# EAGLE design powerblade_2v0 (EAGLE 6.5.0)

## Sheet 1 of 6: Current & Voltage Measurement
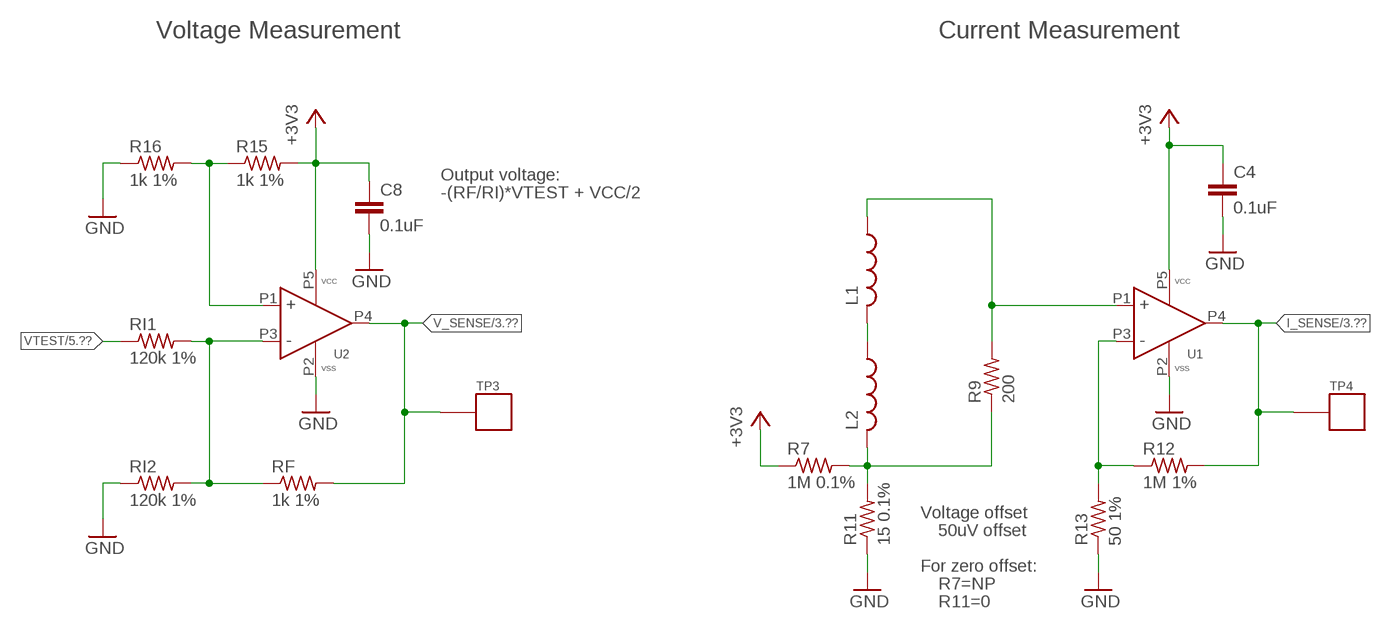
[diagram p0: schematic, sheet 1]

### Parts
C4  0.1uF  C-EUC0402  [C0402]
C8  0.1uF  C-EUC0402  [C0402]
L1  L-USL0805  [L0805]
L2  L-USL0805  [L0805]
R7  1M 0.1%  R-US_R0603  [R0603]
R9  200  R-US_R0603  [R0603]
R11  15 0.1%  R-US_R0603  [R0603]
R12  1M 1%  R-US_R0603  [R0603]
R13  50 1%  R-US_R0603  [R0603]
R15  1k 1%  R-US_R0603  [R0603]
R16  1k 1%  R-US_R0603  [R0603]
RF  1k 1%  R-US_R0603  [R0603]
RI1  120k 1%  R-US_R0603  [R0603]
RI2  120k 1%  R-US_R0603  [R0603]
TP3  TP_STD  [TP]
TP4  TP_STD  [TP]
U1  MAX9910  [SC70-5]
U2  MAX9910  [SC70-5]

### Nets
+3V3: C4.1 C8.1 R7.1 R15.2 U1.P5(VCC) U2.P5(VCC) ; also sheet 2,3,4,5,6
GND: C4.2 C8.2 R11.1 R13.1 R16.1 RI2.1 U1.P2(VSS) U2.P2(VSS) ; also sheet 2,3,4,5,6
I_SENSE: R12.2 TP4.P$1 U1.P4(OUT) ; also sheet 3,4
N$1: R15.1 R16.2 U2.P1(IN+)
N$9: R12.1 R13.2 U1.P3(IN-)
N$10: RF.1 RI1.2 RI2.2 U2.P3(IN-)
N$13: L2.2 R7.2 R9.1 R11.2
N$16: L1.1 R9.2 U1.P1(IN+)
N$25: L1.2 L2.1
V_SENSE: RF.2 TP3.P$1 U2.P4(OUT) ; also sheet 3,4
VTEST: RI1.1 ; also sheet 5

### Notes on the sheet
- Voltage Measurement | Current Measurement
- Output voltage:
- -(RF/RI)*VTEST + VCC/2
- Voltage offset
- 50uV offset
- For zero offset:
- R7=NP
- R11=0

## Sheet 2 of 6: WISP 5.0 Front End
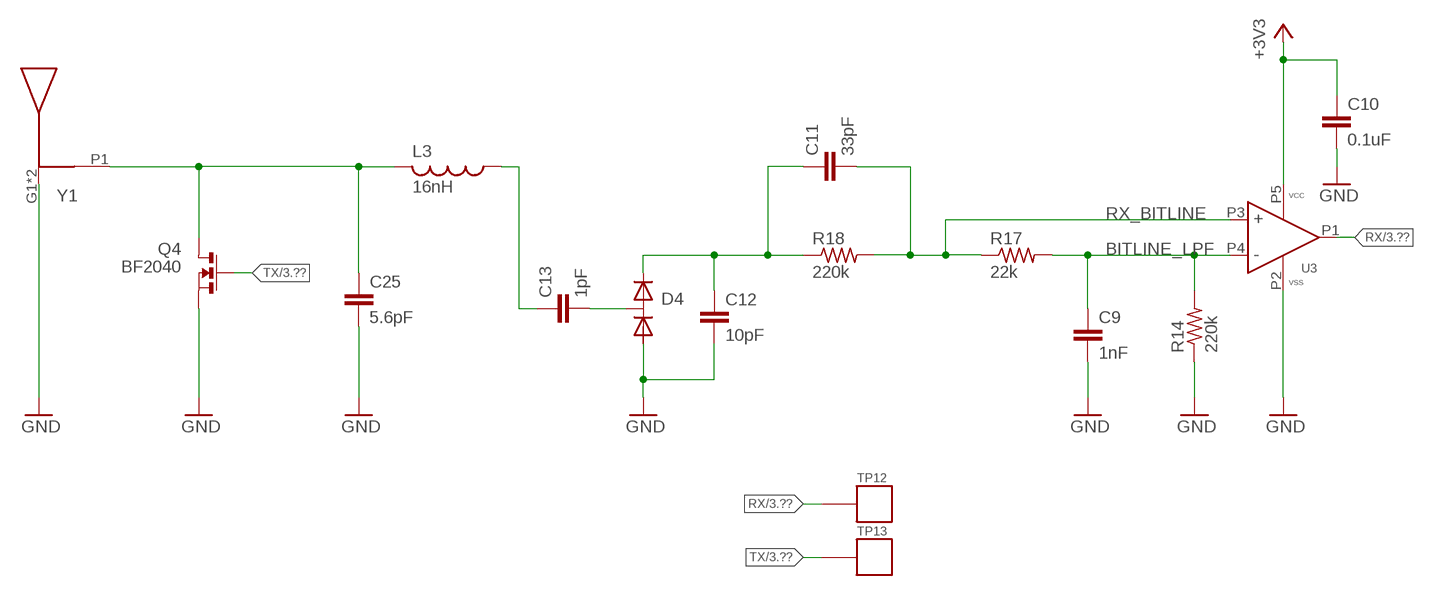
[diagram p1: schematic, sheet 2]

### Parts
C9  1nF  C-EUC0603  [C0603]
C10  0.1uF  C-EUC0603  [C0603]
C11  33pF  C-EUC0603  [C0603]
C12  10pF  C-EUC0603  [C0603]
C13  1pF  C-EUC0603  [C0603]
C25  5.6pF  C-EUC0603  [C0603]
D4  HSMS-285C  [SOT-323]
L3  16nH  L-USL0603  [L0603]
Q4  BF2040  [SOT-143]
R14  220k  R-US_R0603  [R0603]
R17  22k  R-US_R0603  [R0603]
R18  220k  R-US_R0603  [R0603]
TP12  TP_STD  [TP]
TP13  TP_STD  [TP]
U3  NCS2200S  [SC70-5]
Y1  ANT-USP  [ANT-USP]

### Nets
+3V3: C10.1 U3.P5(VCC) ; also sheet 1,3,4,5,6
ANT: C25.1 L3.2 Q4.P2(D) Y1.P1
BITLINE_LPF: C9.1 R14.2 R17.2 U3.P4(IN-)
GND: C9.2 C10.2 C12.2 C25.2 D4.P1 Q4.P1(S) R14.1 U3.P2(VSS) Y1.G1(G) Y1.G2(G) ; also sheet 1,3,4,5,6
N$4: C13.1 L3.1
N$21: C13.2 D4.P3
N$22: C11.1 C12.1 D4.P2 R18.1
RX: TP12.P$1 U3.P1(OUT) ; also sheet 3,4
RX_BITLINE: C11.2 R17.1 R18.2 U3.P3(IN+)
TX: Q4.P3(G) Q4.P4(G) TP13.P$1 ; also sheet 3,4

## Sheet 3 of 6: MSP430
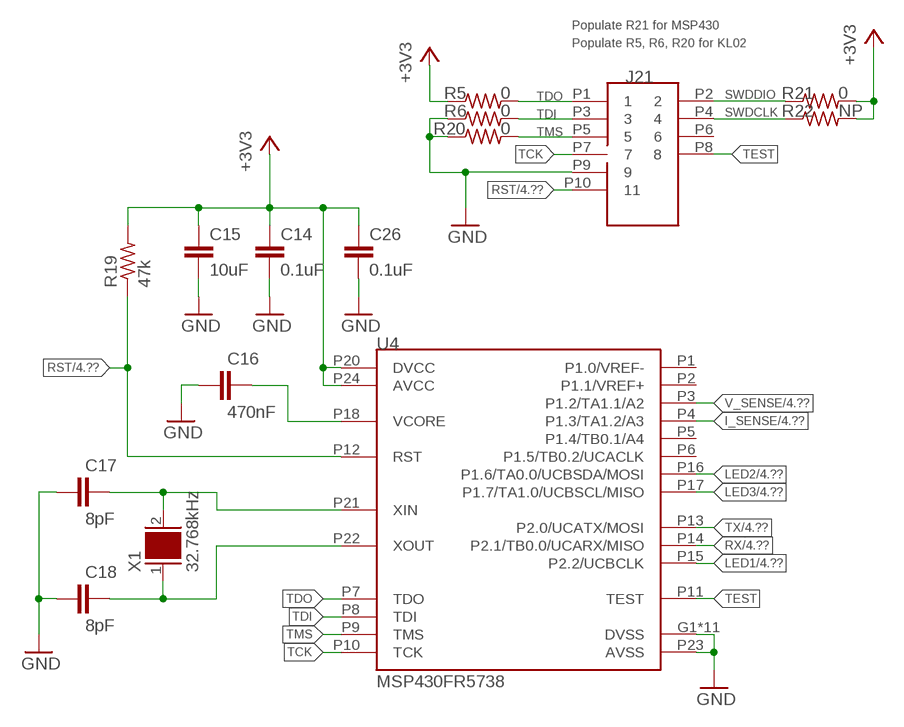
[diagram p2: schematic, sheet 3]

### Parts
C14  0.1uF  C-EUC0603  [C0603]
C15  10uF  C-EUC0603  [C0603]
C16  470nF  C-EUC0603  [C0603]
C17  8pF  C-EUC0603  [C0603]
C18  8pF  C-EUC0603  [C0603]
C26  0.1uF  C-EUC0603  [C0603]
J21  JTAG_14PIN_IDC-NL  [TC2050-IDC-NL-430]
R5  0  R-US_R0603  [R0603]
R6  0  R-US_R0603  [R0603]
R19  47k  R-US_R0603  [R0603]
R20  0  R-US_R0603  [R0603]
R21  0  R-US_R0603  [R0603]
R22  NP  R-US_R0603  [R0603]
U4  MSP430FR5738  [VQFN-24]
X1  32.768kHz  CRYSTAL_0805  [0805]

### Nets
+3V3: C14.1 C15.1 C26.1 R5.1 R19.2 R21.2 R22.2 U4.P20(DVCC) U4.P24(AVCC) ; also sheet 1,2,4,5,6
GND: C14.2 C15.2 C16.1 C17.1 C18.1 C26.2 J21.P9 R6.1 R20.1 U4.G1(DVSS) U4.G2(DVSS) U4.G3(DVSS) U4.G4(DVSS) U4.G5(DVSS) U4.G6(DVSS) U4.G7(DVSS) U4.G8(DVSS) U4.G9(DVSS) U4.P19(DVSS) U4.P23(AVSS) U4.PAD(DVSS) ; also sheet 1,2,4,5,6
I_SENSE: U4.P4(P1.3/TA1.2/A3) ; also sheet 1,4
LED1: U4.P15(P2.2/UCBCLK) ; also sheet 4,6
LED2: U4.P16(P1.6/TA0.0/UCBSDA/MOSI) ; also sheet 4,6
LED3: U4.P17(P1.7/TA1.0/UCBSCL/MISO) ; also sheet 4,6
N$19: C18.2 U4.P22(XOUT) X1.1
N$23: C16.2 U4.P18(VCORE)
N$24: C17.2 U4.P21(XIN) X1.2
RST: J21.P10 R19.1 U4.P12(RST) ; also sheet 4
RX: U4.P14(P2.1/TB0.0/UCARX/MISO) ; also sheet 2,4
SWDCLK: J21.P4 R22.1 ; also sheet 4
SWDDIO: J21.P2 R21.1 ; also sheet 4
TCK: J21.P7 U4.P10(TCK)
TDI: J21.P3 R6.2 U4.P8(TDI)
TDO: J21.P1 R5.2 U4.P7(TDO)
TEST: J21.P8 U4.P11(TEST)
TMS: J21.P5 R20.2 U4.P9(TMS)
TX: U4.P13(P2.0/UCATX/MOSI) ; also sheet 2,4
V_SENSE: U4.P3(P1.2/TA1.1/A2) ; also sheet 1,4
Unconnected: J21.P6 U4.P1(P1.0/VREF-) U4.P2(P1.1/VREF+) U4.P5(P1.4/TB0.1/A4) U4.P6(P1.5/TB0.2/UCACLK)

### Notes on the sheet
- Populate R21 for MSP430
- Populate R5, R6, R20 for KL02

## Sheet 4 of 6: KL02
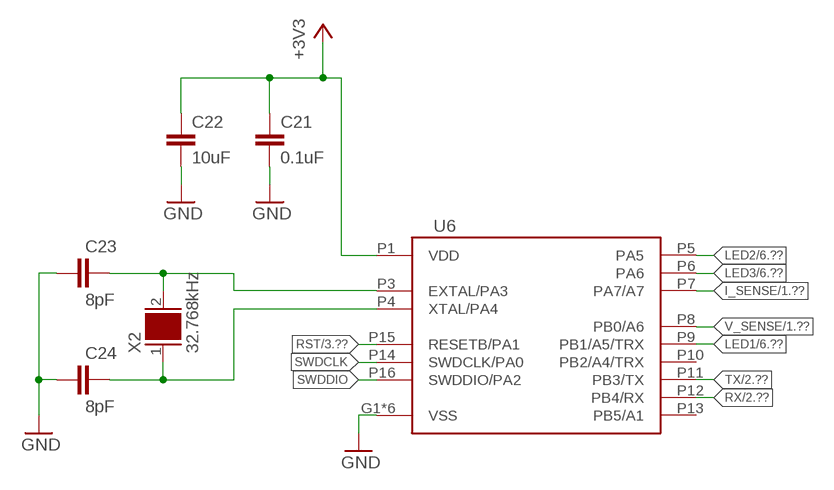
[diagram p3: schematic, sheet 4]

### Parts
C21  0.1uF  C-EUC0603  [C0603]
C22  10uF  C-EUC0603  [C0603]
C23  8pF  C-EUC0603  [C0603]
C24  8pF  C-EUC0603  [C0603]
U6  KL02  [WQFN-16]
X2  32.768kHz  CRYSTAL_0805  [0805]

### Nets
+3V3: C21.1 C22.1 U6.P1(VDD) ; also sheet 1,2,3,5,6
GND: C21.2 C22.2 C23.1 C24.1 U6.G1(VSS) U6.G3(VSS) U6.G7(VSS) U6.G9(VSS) U6.P2(VSS) U6.PAD(VSS) ; also sheet 1,2,3,5,6
I_SENSE: U6.P7(PA7/A7) ; also sheet 1,3
LED1: U6.P9(PB1/A5/TRX) ; also sheet 3,6
LED2: U6.P5(PA5) ; also sheet 3,6
LED3: U6.P6(PA6) ; also sheet 3,6
N$5: C24.2 U6.P4(XTAL/PA4) X2.1
N$6: C23.2 U6.P3(EXTAL/PA3) X2.2
RST: U6.P15(RESETB/PA1) ; also sheet 3
RX: U6.P12(PB4/RX) ; also sheet 2,3
SWDCLK: U6.P14(SWDCLK/PA0) ; also sheet 3
SWDDIO: U6.P16(SWDDIO/PA2) ; also sheet 3
TX: U6.P11(PB3/TX) ; also sheet 2,3
V_SENSE: U6.P8(PB0/A6) ; also sheet 1,3
Unconnected: U6.P10(PB2/A4/TRX) U6.P13(PB5/A1)

## Sheet 5 of 6: AC-DC Power Supply
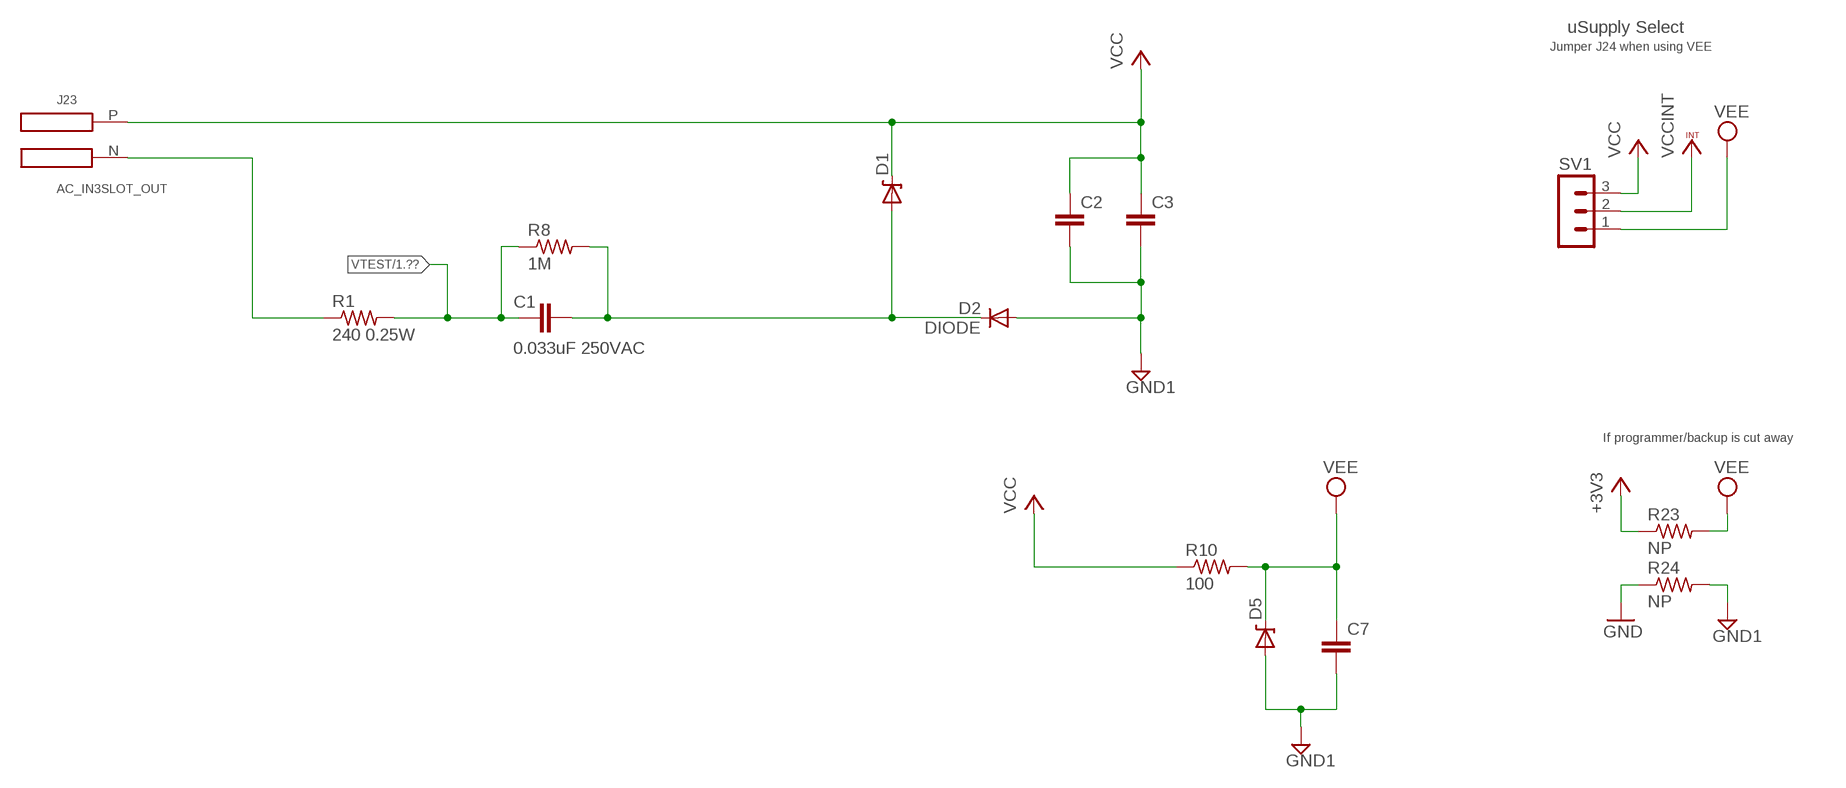
[diagram p4: schematic, sheet 5]

### Parts
C1  0.033uF 250VAC  C-EUC2220K  [C2220K]
C2  C-EUC0805  [C0805]
C3  C-EUC0603  [C0603]
C7  C-EUC0603  [C0603]
D1  ZENERBZT52  [BZT52]
D2  DIODE  [BAS521]
D5  ZENERBZT52  [BZT52]
J23  AC_IN3SLOT_OUT  [AC3_SLOT_OUT]
R1  240 0.25W  R-US_R0603  [R0603]
R8  1M  R-US_R0603  [R0603]
R10  100  R-US_R0603  [R0603]
R23  NP  R-US_R0603  [R0603]
R24  NP  R-US_R0603  [R0603]
SV1  MA03-1STR  [MA03-1]

### Nets
+3V3: R23.1 ; also sheet 1,2,3,4,6
GND: R24.1 ; also sheet 1,2,3,4,6
GND1: C2.2 C3.2 C7.2 D2.A D5.A R24.2 ; also sheet 6
N$2: J23.N R1.1
N$3: C1.1 D1.A D2.C R8.2
VCC: C2.1 C3.1 D1.C J23.P R10.1 SV1.3
VCCINT: SV1.2 ; also sheet 6
VEE: C7.1 D5.C R10.2 R23.2 SV1.1
VTEST: C1.2 R1.2 R8.1 ; also sheet 1

### Notes on the sheet
- uSupply Select
- Jumper J24 when using VEE
- If programmer/backup is cut away

## Sheet 6 of 6: Other Power
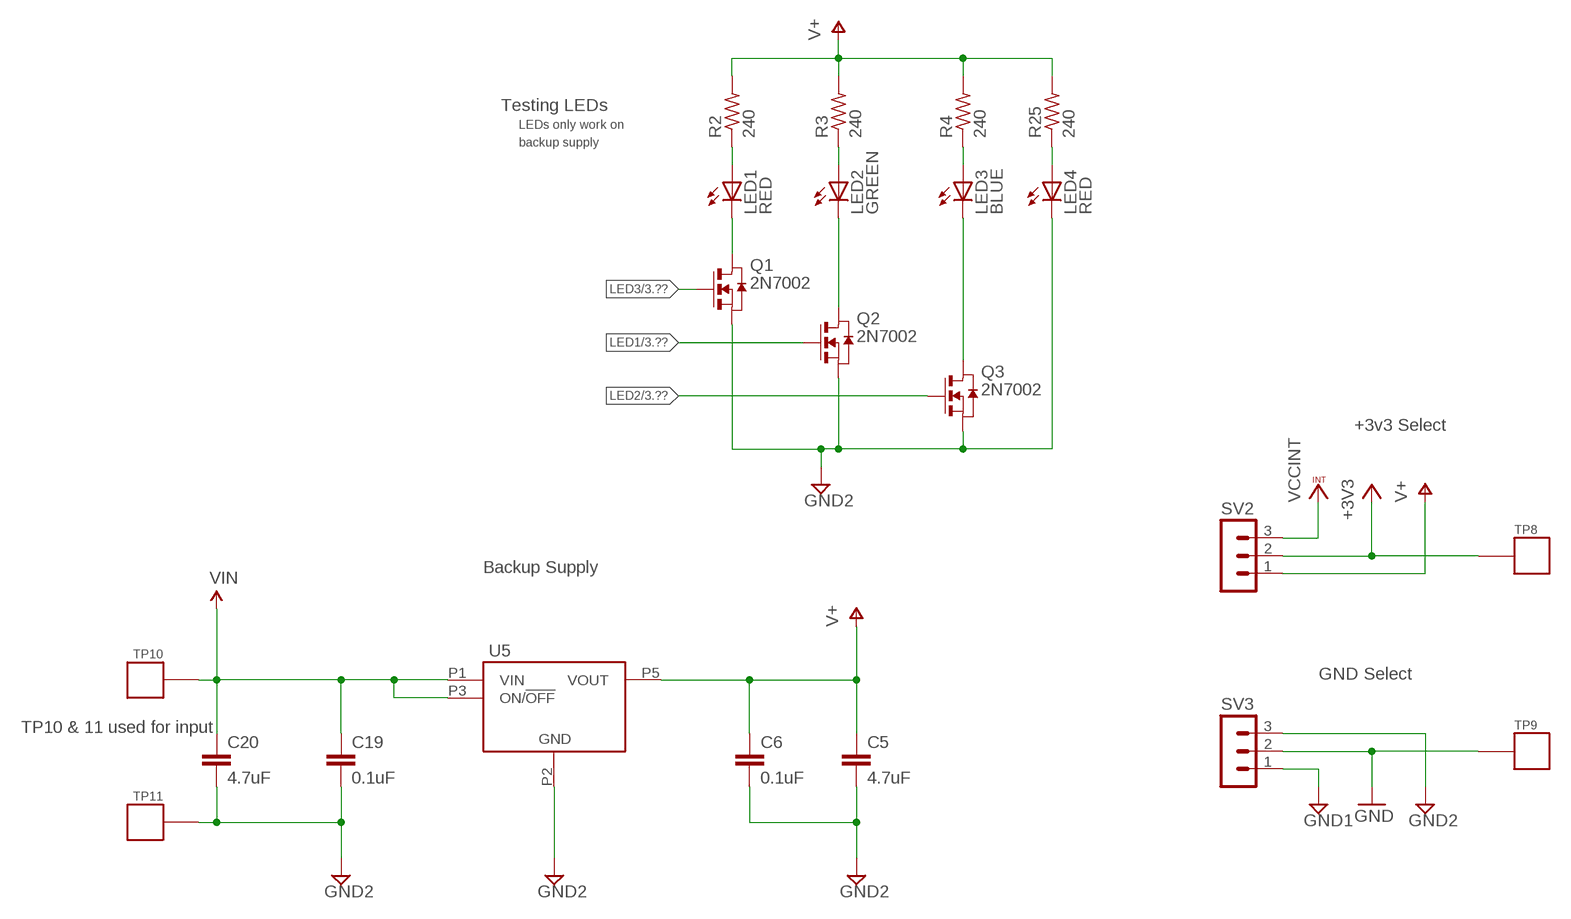
[diagram p5: schematic, sheet 6]

### Parts
C5  4.7uF  C-EUC0603  [C0603]
C6  0.1uF  C-EUC0603  [C0603]
C19  0.1uF  C-EUC0603  [C0603]
C20  4.7uF  C-EUC0603  [C0603]
LED1  RED  LED0603  [LED-0603]
LED2  GREEN  LED0603  [LED-0603]
LED3  BLUE  LED0603  [LED-0603]
LED4  RED  LED0603  [LED-0603]
Q1  2N7002  [SC-70-3]
Q2  2N7002  [SC-70-3]
Q3  2N7002  [SC-70-3]
R2  240  R-US_R0603  [R0603]
R3  240  R-US_R0603  [R0603]
R4  240  R-US_R0603  [R0603]
R25  240  R-US_R0603  [R0603]
SV2  MA03-1STR  [MA03-1]
SV3  MA03-1STR  [MA03-1]
TP8  TP_STD  [TP]
TP9  TP_STD  [TP]
TP10  TP_STD  [TP]
TP11  TP_STD  [TP]
U5  LP2980  [SOT-23-5]

### Nets
+3V3: SV2.2 TP8.P$1 ; also sheet 1,2,3,4,5
GND: SV3.2 TP9.P$1 ; also sheet 1,2,3,4,5
GND1: SV3.1 ; also sheet 5
GND2: C5.2 C6.2 C19.2 C20.2 LED4.C Q1.P2(S) Q2.P2(S) Q3.P2(S) SV3.3 TP11.P$1 U5.P2(GND)
LED1: Q2.P1(G) ; also sheet 3,4
LED2: Q3.P1(G) ; also sheet 3,4
LED3: Q1.P1(G) ; also sheet 3,4
N$7: LED1.A R2.1
N$8: LED1.C Q1.P3(D)
N$11: LED2.C Q2.P3(D)
N$12: LED2.A R3.1
N$14: LED3.A R4.1
N$15: LED3.C Q3.P3(D)
N$17: LED4.A R25.1
V+: C5.1 C6.1 R2.2 R3.2 R4.2 R25.2 SV2.1 U5.P5(VOUT)
VCCINT: SV2.3 ; also sheet 5
VIN: C19.1 C20.1 TP10.P$1 U5.P1(VIN) U5.P3(ON/!OFF!)

### Notes on the sheet
- Testing LEDs
- LEDs only work on
- backup supply
- +3v3 Select
- Backup Supply
- GND Select
- TP10 & 11 used for input

## Library data of the parts
C1 = rcl:C-EU: CAPACITOR, European symbol; DIGIKEY: 490-4238-1-ND
C2 = rcl:C-EU: CAPACITOR, European symbol; DIGIKEY: 445-8238-1-ND
C3 = rcl:C-EU: CAPACITOR, European symbol; DIGIKEY: 445-9077-1-ND
C4 C8 = rcl:C-EU: CAPACITOR, European symbol; DIGIKEY: 445-1265-1-ND
C5 C20 = rcl:C-EU: CAPACITOR, European symbol; DIGIKEY: 490-3302-1-ND
C6 C10 C14 C19 C21 C26 = rcl:C-EU: CAPACITOR, European symbol; DIGIKEY: 445-1316-1-ND
C7 = rcl:C-EU: CAPACITOR, European symbol; DIGIKEY: 1276-2383-1-ND
C9 = rcl:C-EU: CAPACITOR, European symbol; DIGIKEY: 490-6377-1-ND
C11 = rcl:C-EU: CAPACITOR, European symbol; DIGIKEY: 399-7894-1-ND
C12 = rcl:C-EU: CAPACITOR, European symbol; DIGIKEY: 1276-2151-1-ND
C13 = rcl:C-EU: CAPACITOR, European symbol; DIGIKEY: 712-1323-1-ND
C15 C22 = rcl:C-EU: CAPACITOR, European symbol; DIGIKEY: 1276-1119-1-ND
C16 = rcl:C-EU: CAPACITOR, European symbol; DIGIKEY: 445-5192-1-ND
C17 C18 C23 C24 = rcl:C-EU: CAPACITOR, European symbol; DIGIKEY: 1276-1817-1-ND
C25 = rcl:C-EU: CAPACITOR, European symbol; DIGIKEY: 712-1360-1-ND
D1 = powerfilm:ZENER; DIGIKEY: BZT52C3V3T-7DICT-ND; DIGIKEY_2: BZT585B5V1T-7DICT-ND; DIGIKEY_3: BZT585B6V8T-7DICT-ND
D2 = powerfilm:DIODE; DIGIKEY: BAS521-7DICT-ND
D4 = powerfilm:HSMS-285C; DIGIKEY: 516-2558-ND
D5 = powerfilm:ZENER; DIGIKEY: BZT52C3V3T-7DICT-ND
J21 = ibat:JTAG_14PIN; DIGIKEY: NP; TAG-CONNECT: TC2050-IDC-NL-430
J23 = powerfilm:AC_IN; DIGIKEY: 3M11307-ND
L1 L2 = rcl:L-US: INDUCTOR, American symbol
L3 = rcl:L-US: INDUCTOR, American symbol; DIGIKEY: 732-1728-1-ND; DIGIKEY_2: A103728CT-ND
LED1 LED4 = SparkFun-LED:LED: LEDs Standard schematic elements and footprints for 5mm, 3mm, 1206, and 0603 sized LEDs. 5mm - Spark Fun Electronics SKU : COM-00529 (and others); DIGIKEY: 1080-1400-1-ND
LED2 = SparkFun-LED:LED: LEDs Standard schematic elements and footprints for 5mm, 3mm, 1206, and 0603 sized LEDs. 5mm - Spark Fun Electronics SKU : COM-00529 (and others); DIGIKEY: 1080-1402-1-ND
LED3 = SparkFun-LED:LED: LEDs Standard schematic elements and footprints for 5mm, 3mm, 1206, and 0603 sized LEDs. 5mm - Spark Fun Electronics SKU : COM-00529 (and others); DIGIKEY: 1080-1401-1-ND
Q1-Q3 = nav:2N7002; DIGIKEY: 2N7002WCT-ND
Q4 = powerfilm:BF2040; DIGIKEY: BF 2040 E6814CT-ND
R1 = rcl:R-US_: RESISTOR, American symbol; DIGIKEY: RHM240DCT-ND
R2-R4 R25 = rcl:R-US_: RESISTOR, American symbol; DIGIKEY: P240GCT-ND
R5 R6 R20 R21 = rcl:R-US_: RESISTOR, American symbol; DIGIKEY: P0.0GCT-ND
R7 R12 = rcl:R-US_: RESISTOR, American symbol; DIGIKEY: A102234CT-ND
R8 = rcl:R-US_: RESISTOR, American symbol; DIGIKEY: MCT0603-1.00M-CFCT-ND
R9 = rcl:R-US_: RESISTOR, American symbol; DIGIKEY: P200HCT-ND
R10 = rcl:R-US_: RESISTOR, American symbol; DIGIKEY: P100GCT-ND
R11 = rcl:R-US_: RESISTOR, American symbol; DIGIKEY: A109933CT-ND
R13 = rcl:R-US_: RESISTOR, American symbol; DIGIKEY: P49.9HCT-ND
R14 R18 = rcl:R-US_: RESISTOR, American symbol; DIGIKEY: P220KDBCT-ND
R15 R16 RF = rcl:R-US_: RESISTOR, American symbol; DIGIKEY: P1.00KHCT-ND
R17 = rcl:R-US_: RESISTOR, American symbol; DIGIKEY: P22KDBCT-ND
R19 = rcl:R-US_: RESISTOR, American symbol; DIGIKEY: P47KGCT-ND
R22-R24 = rcl:R-US_: RESISTOR, American symbol; DIGIKEY: NP
RI1 RI2 = rcl:R-US_: RESISTOR, American symbol; DIGIKEY: P120KHCT-ND
SV1-SV3 = con-lstb:MA03-1: PIN HEADER; DIGIKEY: 3M9448-ND; OC_FARNELL: unknown; OC_NEWARK: unknown
TP3 TP4 TP8-TP13 = skyspecs:TP
U1 U2 = powerfilm:MAX9910; DIGIKEY: MAX9910EXK+TCT-ND
U3 = powerfilm:NCS2200S; DIGIKEY: NCS2200SQ2T2GOSCT-ND
U4 = powerfilm:MSP430FR5738; DIGIKEY: 296-29232-1-ND
U5 = powerfilm:LP2980; DIGIKEY: LP2980AIM5X-3.3/NOPBCT-ND
U6 = powerfilm:KL02; DIGIKEY: MKL02Z8VFG4-ND
X1 X2 = general:CRYSTAL_0805; DIGIKEY: 535-12373-1-ND
Y1 = powerfilm:ANT-USP; DIGIKEY: ANT-916-USP-ND; DIGIKEY_2: 732-1835-1-ND

## Board
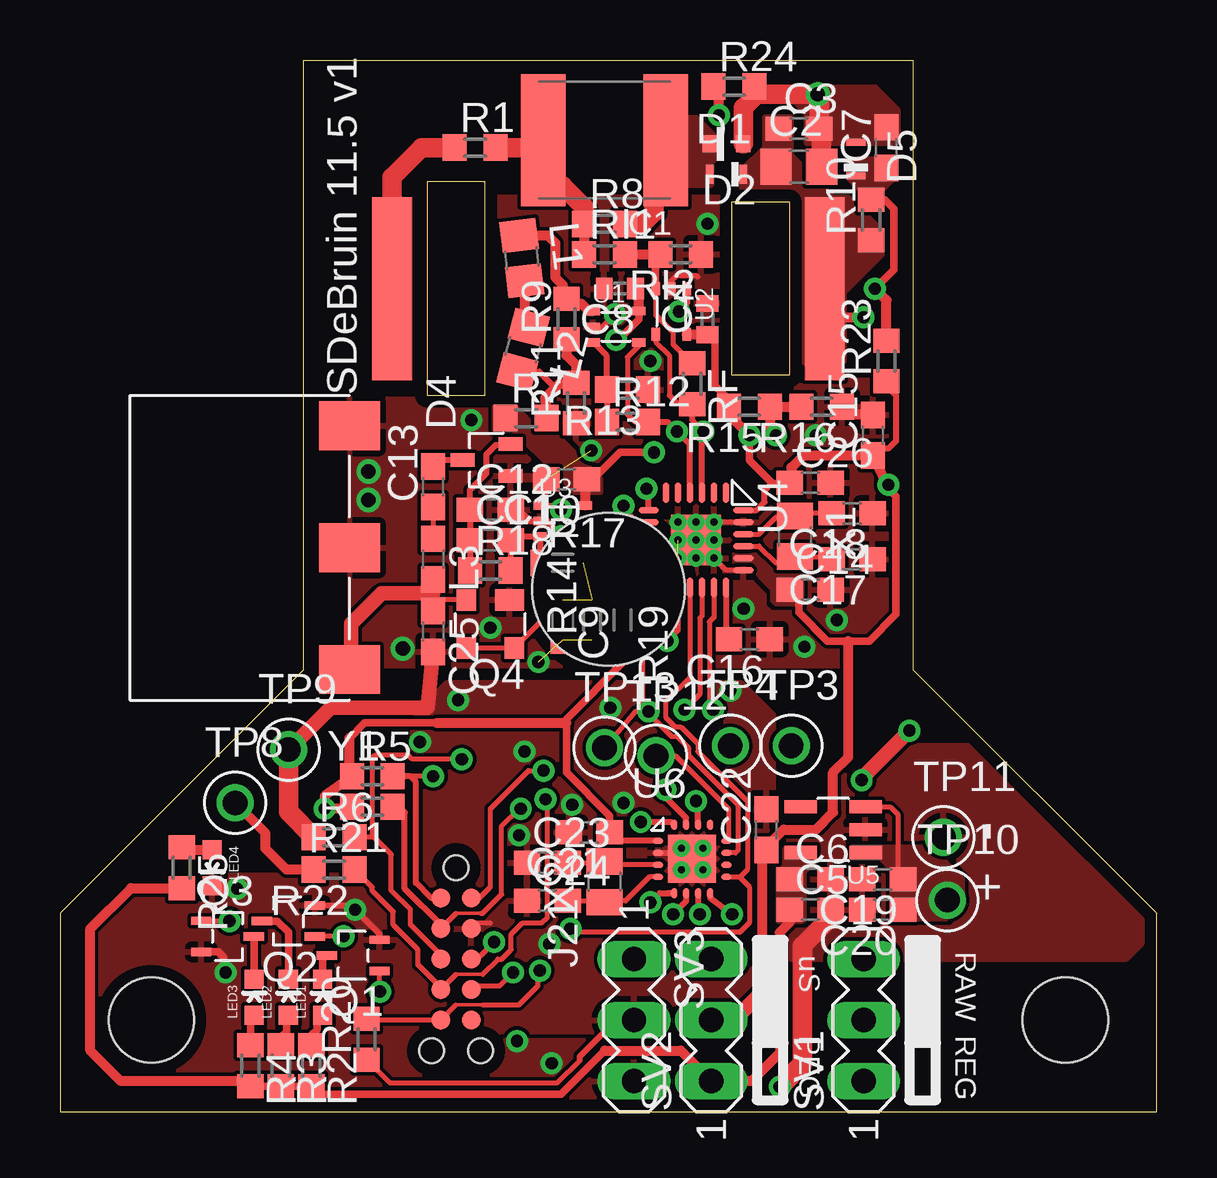
[diagram p6: board, top side]
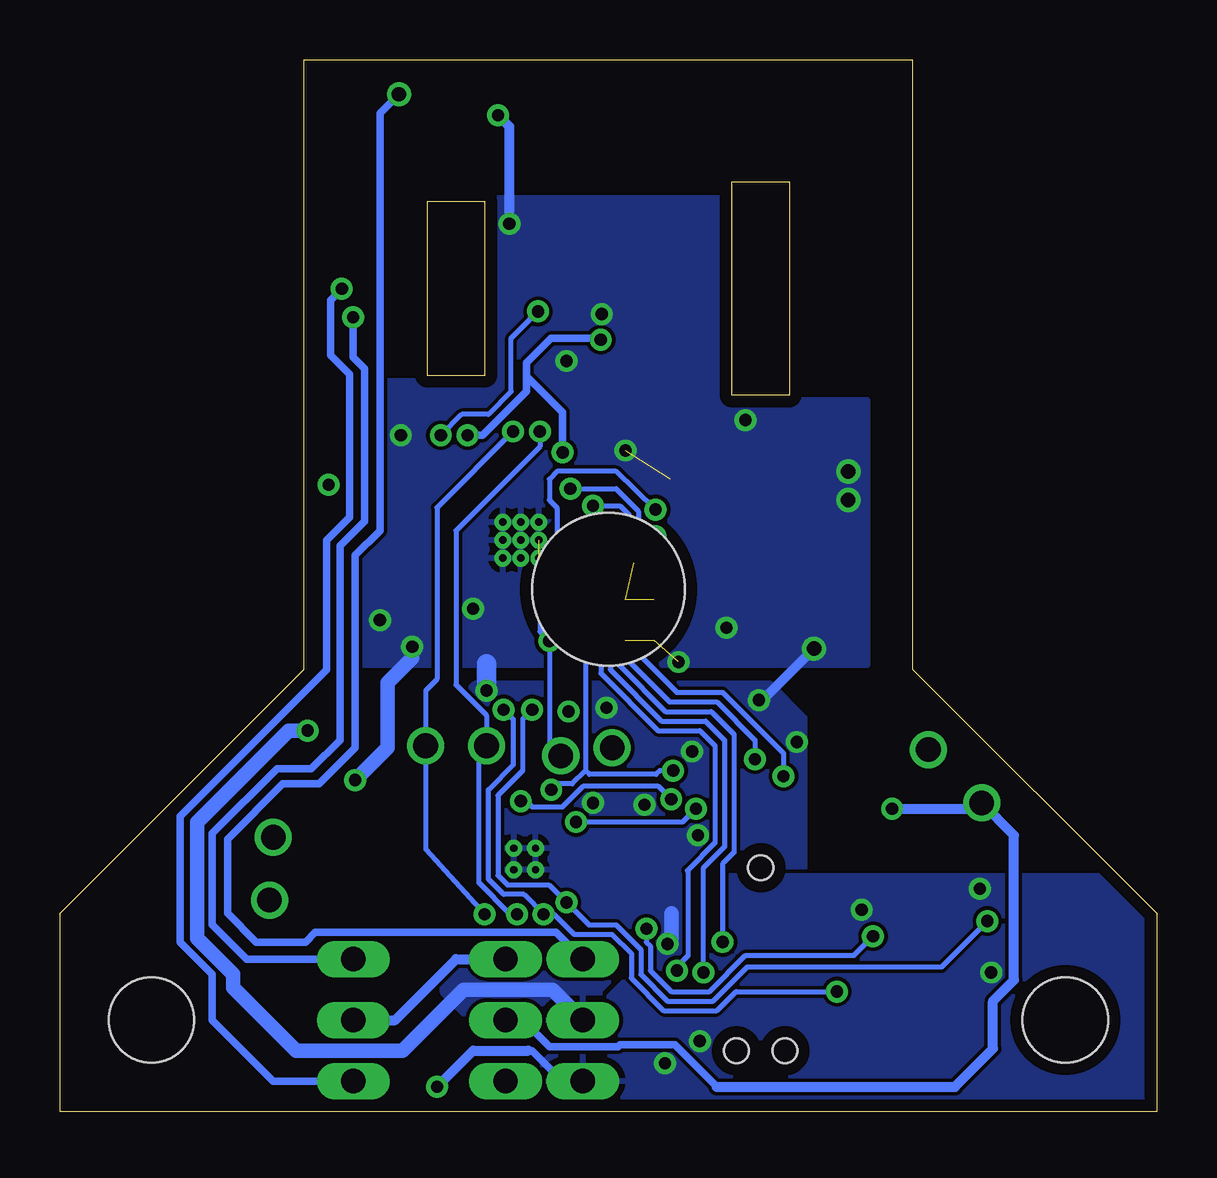
[diagram p7: board, bottom side, seen from below]

Size 45.72 x 43.81 mm. Coordinates in mm from the lower left corner, seen from the top.
Outline: 35.56,18.41 45.72,8.25 45.72,0 0,0 0,8.25 10.16,18.41
Copper layers (1*16): Top 0.0178mm / dielectric 59mil / Bottom 0.0178mm
Design rules "SSC-EAGLE-2Lyr_v1.0.0.3": minimum track width 6mil, minimum drill 14mil, track to track 6mil, track to pad 6mil, pad to pad 6mil, via to via 6mil, smd to smd 6mil, copper to edge 20mil, drill to drill 16mil, minimum pad ring 8mil, minimum via ring 8mil, stop-mask expansion 3mil, vias tented up to drill 0mil, thermal gap 10mil
Holes 3.56 mm at 41.91,3.81 3.81,3.81

### Footprints (pad centres in the part's own frame; a part is rotated, then mirrored left to right if it is on the bottom)
C2220K = smd 1.85 x 5.5: 1 -2.55,0; 2 2.55,0
C0805 = smd 1.3 x 1.5: 1 -0.95,0; 2 0.95,0
C0603 = smd 1.1 x 1: 1 -0.85,0; 2 0.85,0
C0402 = smd 0.7 x 0.9: 1 -0.65,0; 2 0.65,0
BZT52 = smd 0.3 x 0.8: A -0.7,0; C 0.7,0
BAS521 = smd 0.6 x 0.7: A -0.7,0; C 0.7,0
SOT-323 = smd 0.559 x 0.991: P1 -0.66,-1.003; P2 0.66,-1.003; P3 0,1.003
TC2050-IDC-NL-430 = smd 0.787 x 0.787: P1 -2.54,-0.635; P2 -1.27,-0.635; P3 0,-0.635; P4 1.27,-0.635; P5 2.54,-0.635; P6 2.54,0.635; P7 1.27,0.635; P8 0,0.635; P9 -1.27,0.635; P10 -2.54,0.635 | hole 1.029: -3.81,0; 3.81,1.016; 3.81,-1.016
AC3_SLOT_OUT = smd 1.651 x 7.62: N -9.017,0; P 9.017,0 | hole 6.35: 0,-12.522
L0805 = smd 1.3 x 1.5: 1 -0.95,0; 2 0.95,0
L0603 = smd 1.1 x 1: 1 -0.85,0; 2 0.85,0
LED-0603 = smd 0.8 x 0.8: A 0,-0.75; C 0,0.75
SC-70-3 = smd 0.85 x 0.35: P1 -1.1,0.65; P2 -1.1,-0.65; P3 1.1,0
SOT-143 = smd 1.2 x 0.9: P1 -0.8,-1 | smd 0.8 x 0.9: P2 1,-1; P3 1,1; P4 -1,1
R0603 = smd 1 x 1.1: 1 -0.85,0; 2 0.85,0
MA03-1 = drill 1.016 long: 1 -2.54,0; 2 0,0; 3 2.54,0
TP = drill 1.029: P$1 0,0
SC70-5 = smd 0.55 x 0.35: P1 -0.95,0.65; P2 -0.95,0; P3 -0.95,-0.65; P4 0.95,-0.65; P5 0.95,0.65
VQFN-24 = drill 0.3 pad 0.5: G1 -0.75,0.75; G2 0,0.75; G3 0.75,0.75; G4 -0.75,0; G5 0,0; G6 0.75,0; G7 -0.75,-0.75; G8 0,-0.75; G9 0.75,-0.75 | smd 0.85 x 0.28: P1 -1.975,1.25; P2 -1.975,0.75; P3 -1.975,0.25; P4 -1.975,-0.25; P5 -1.975,-0.75; P6 -1.975,-1.25; P13 1.975,-1.25; P14 1.975,-0.75; P15 1.975,-0.25; P16 1.975,0.25; P17 1.975,0.75; P18 1.975,1.25 | smd 0.28 x 0.85: P7 -1.25,-1.975; P8 -0.75,-1.975; P9 -0.25,-1.975; P10 0.25,-1.975; P11 0.75,-1.975; P12 1.25,-1.975; P19 1.25,1.975; P20 0.75,1.975; P21 0.25,1.975; P22 -0.25,1.975; P23 -0.75,1.975; P24 -1.25,1.975 | smd 2.1 x 2.1: PAD 0,0
SOT-23-5 = smd 1.35 x 0.55: P1 -1.35,0.95; P2 -1.35,0; P3 -1.35,-0.95; P4 1.35,-0.95; P5 1.35,0.95
WQFN-16 = drill 0.3 pad 0.5: G1 -0.45,0.45; G3 0.45,0.45; G7 -0.45,-0.45; G9 0.45,-0.45 | smd 0.45 x 0.25: P1 -1.425,0.75; P2 -1.425,0.25; P3 -1.425,-0.25; P4 -1.425,-0.75; P9 1.425,-0.75; P10 1.425,-0.25; P11 1.425,0.25; P12 1.425,0.75 | smd 0.25 x 0.45: P5 -0.75,-1.425; P6 -0.25,-1.425; P7 0.25,-1.425; P8 0.75,-1.425; P13 0.75,1.425; P14 0.25,1.425; P15 -0.25,1.425; P16 -0.75,1.425 | smd 2 x 2: PAD 0,0
0805 = smd 1.1 x 1.5: 1 -0.85,0; 2 0.85,0
ANT-USP = smd 2.032 x 2.54: G1 0,0; G2 5.08,0; P1 -5.08,0

### Placement (x,y rotation side)
C1  22.7,40.48 180 top
C2  30.8,39.37 0 top
C3  30.8,40.96 0 top
C4  26.99,33.02 90 top
C5  31.27,8.41 0 top
C6  31.27,9.68 0 top
C7  34.45,40.16 90 top
C8  23.34,34.29 180 top
C9  20.95,20.48 270 top
C10  21.11,26.35 180 top
C11  17.94,23.81 0 top
C12  17.94,25.08 0 top
C13  15.56,26.03 90 top
C14  31.27,21.75 0 top
C15  33.89,28.18 90 top
C16  28.73,19.68 180 top
C17  33.02,23.02 180 top
C18  33.02,24.92 180 top
C19  34.29,9.68 180 top
C20  34.29,8.41 180 top
C21  22.07,11.64 180 top
C22  29.45,11.75 90 top
C23  20.32,10.37 0 top
C24  20.32,8.78 0 top
C25  15.56,20 270 top
C26  31.27,26.19 0 top
D1  27.78,39.05 0 top
D2  27.78,40.32 180 top
D4  17.78,27.15 90 top
D5  33.18,39.69 270 top
J21  16.51,6.35 270 top
J23  22.86,34.29 0 top
L1  19.25,35.56 277.1 top
L2  19.3,31.75 255.3 top
L3  15.56,23.02 270 top
LED1  10.95,4.76 0 top
LED2  9.52,4.76 0 top
LED3  8.1,4.76 0 top
LED4  6.35,10.16 180 top
Q1  12.22,6.51 180 top
Q2  9.52,7.94 180 top
Q3  6.98,7.3 0 top
Q4  17.94,20.32 180 top
R1  17.3,40.16 0 top
R2  10.48,1.91 270 top
R3  9.21,1.91 270 top
R4  7.94,1.91 270 top
R5  13.02,13.97 0 top
R6  11.43,11.43 0 top
R7  19.43,28.89 0 top
R8  22.7,36.99 0 top
R9  21.11,33.02 90 top
R10  33.81,37.15 90 top
R11  21.51,29.53 90 top
R12  23.65,28.73 0 top
R13  23.65,30.08 180 top
R14  22.17,20.48 90 top
R15  28.73,29.37 180 top
R16  31.75,29.37 180 top
R17  20.95,22.86 0 top
R18  17.94,22.54 0 top
R19  23.44,20.48 270 top
R20  12.78,3.02 90 top
R21  13.02,12.7 180 top
R22  11.43,10.08 180 top
R23  34.45,31.27 90 top
R24  28.1,42.7 0 top
R25  5.08,10.16 270 top
RF  26.35,30.32 270 top
RI1  22.7,35.72 0 top
RI2  25.88,35.72 180 top
SV1  33.5,3.81 90 top
SV2  27.15,3.81 90 top
SV3  23.93,3.81 270 top
TP3  30.48,15.24 0 top
TP4  27.94,15.24 0 top
TP8  7.3,12.86 0 top
TP9  9.52,15.08 0 top
TP10  36.99,8.81 0 top
TP11  36.83,11.43 0 top
TP12  24.84,14.82 0 top
TP13  22.7,15.16 0 top
U1  23.18,32.7 0 top
U2  25.48,33.34 270 top
U3  20.95,24.61 0 top
U4  26.51,23.81 270 top
U5  32.23,11.75 180 top
U6  26.35,10.53 0 top
X1  30.64,23.97 270 top
X2  22.7,9.57 90 top
Y1  12.06,23.49 90 top

### Tracks (layer width: path | path; a pad name or v marks a point on that pad's centre or on a via)
+3V3  (via drill 0.51)
  Top 0.254: U4.P24 29.03,25.06 29.37,25.4 29.37,25.88 29.69,26.19 C26.1 | U6.P1 23.28,11.27 arc-90 C21.1 | R23.1 34.45,30.24 34.85,29.84 34.85,27.94 34.53,27.62 34.19,27.62 C15.1
  Top 0.305: v23.18,32.16 23.27,32.16 24.13,33.02 U1.P5 | R15.2 27.88,29.66 27.3,30.24 27.3,32.05 C4.1 | v28.73,28.18 28.73,27.15 29.69,26.19 | C14.1 30.8,21.38 30.8,20.8 31.99,19.61 32.86,19.61 33.73,19.61 34.85,20.72 34.85,25.64 34.61,25.88 v34.53,26.11 | C21.1 22.92,12.33 21.11,14.13 21.11,16.19 21.11,16.35 23.5,18.73 R19.2 | C10.1 22.22,26.35 23.34,27.46 v24.77,27.46 | 12.06,15.56 12.7,16.19 14.45,16.19 15.72,16.19
  Top 0.406: U2.P5 26.97,32.39 C4.1 | U1.P5 24.13,34.15 C8.1 | R15.2 27.88,29.03 v28.73,28.18 | U3.P5 21.91,26.29 C10.1 | C26.1 30.48,26.25 30.48,26.83 30.98,27.33 C15.1 34.45,26.19 v34.53,26.11 | 32.86,19.61 32.86,14.76 32.23,14.13 32.23,12.46 31.51,11.75 30.16,11.75 29.61,11.19 29.35,11.19 C22.1 arc90 29.29,10.82 29.29,5 29.21,4.92 | R21.2 12.09,12.62 v11.03,12.62 11.03,13.15 R5.1 12.06,14.07 12.06,15.56 | R22.2 9.45,10.08 8.57,10.95 8.57,11.59 TP8.P$1 | 15.72,16.19 21.11,16.19
  Top 0.61: SV2.2 28.1,3.81 29.21,4.92
  Bottom 0.305: 26.27,30.64 26.27,31.19 25.24,32.23 23.24,32.23 v23.18,32.16 | 26.27,30.64 24.77,29.13 v24.77,27.46 | 26.27,30.64 26.27,30 28.1,28.18 v28.73,28.18 | 18.34,1.03 20.08,2.78 22.38,2.78 22.46,2.7 25.32,2.7 26.43,3.81 SV2.2
  Bottom 0.406: 18.34,1.03 8.41,1.03 6.83,2.62 6.83,4.6 5.95,5.48 5.95,11.51 TP8.P$1 7.54,12.62 v11.03,12.62
  pour Top (no thermals): 28.73,23.34 28.1,23.34 28.1,22.86 28.57,22.86 29.69,21.75 29.69,21.27 29.84,21.11 30.8,21.11 30.96,21.27 30.96,22.54 30.8,22.7 30,22.7 29.37,23.34
  pour Top (no thermals): 18.1,28.42 18.89,28.42 20.64,26.67 21.43,25.8 22.54,25.8 22.54,26.35 20.64,28.26 20.08,28.26 18.97,29.37 18.1,29.37
ANT
  Top 0.203: L3.2 15.56,21.59 | 15.56,21.59 C25.1 | Q4.P2 15.83,21.32 15.56,21.59
  Top 0.61: Y1.P1 12.14,18.41 12.14,20.32 13.41,21.59 15.56,21.59
BITLINE_LPF  (2 unrouted)
  Top 0.254: U3.P4 21.91,22.96 R17.2
  pour Top (no thermals): 20.56,20.88 22.62,20.88 22.62,22.86 22.22,23.26 21.51,23.26 21.51,22.62 20.56,21.67
GND  (via drill 0.51, 0.6)  (4 unrouted)
  Top 0.203: U2.P2 25.48,34.6 25.72,34.85 26.51,34.85 26.59,34.77 | U1.P2 22.61,32.7 v23.14,33.23 | U4.P23 27.1,24.56 26.67,24.13 26.67,23.97 U4.PAD | U4.P19 27.76,22.56 U4.G3 | R20.1 13.75,1.19 20.72,1.19 21.67,2.14 | J21.P9 17.38,7.86 17.94,7.86
  Top 0.254: C12.2 19.03,24.84 19.37,24.84 19.61,24.61 U3.P2 20.32,24.61 v20.89,23.97 | 21.67,2.14 21.67,2.3 23.18,3.81 SV3.2 | U6.P2 25.7,10.77 arc90 U6.G1 | U6.G9 arc90 U6.PAD
  Top 0.406: v27.46,41.51 27.46,42.49 R24.1 | C15.2 32.94,29.03 R16.1
  Top 0.61: C25.2 15.32,16.83 11.27,16.83 TP9.P$1 | v35.4,15.88 33.42,13.89 v33.42,13.81
  Top 0.813: R6.1 9.52,12.48 TP9.P$1
  Bottom 0.406: v26.99,36.99 26.99,41.04 v27.46,41.51 | v14.29,19.29 16.43,17.14 v16.59,17.14
  Bottom 0.61: v20.4,6.98 20.24,7.14 20.24,8.25 | SV3.2 25.2,5.08 28.89,5.08 31.43,2.54 35.88,2.54 38.5,5.16 38.5,5.71 40,7.22 40,12.06 36.2,15.88 v35.4,15.88 | v33.42,13.81 32.07,15.16 32.07,17.86 31.04,18.89 v31.04,19.37
  Bottom 0.813: v27.94,17.54 27.94,18.65
  other vias: 24.61,31.27 31.51,28.18 17.14,28.81 22.15,27.54 17.94,20.16 19.94,18.73 32.38,20.48 28.5,20.95 19.13,11.51 21.35,12.78 23.5,12.86 19.37,15 22.94,16.83 15,15.4 12.86,26.67 12.86,25.48
  pour Top (rank 6): 35.56,30.48 27.94,30.48 27.94,38.1 17.78,38.1 17.78,29.69 12.06,29.69 12.06,18.57 35.56,18.57
  pour Bottom (rank 6): 35.56,30.48 27.94,30.48 27.94,38.1 17.78,38.1 17.78,29.69 12.06,29.69 12.06,18.57 35.56,18.57
  pour Top (rank 5): 14.68,16.43 14.68,4.45 15.8,3.33 28.18,3.33 29.77,4.92 29.77,16.51 28.42,17.86 16.11,17.86
  pour Bottom (rank 6): 14.68,16.43 14.68,4.45 15.8,3.33 28.18,3.33 29.77,4.92 29.77,16.51 28.42,17.86 16.11,17.86
GND1  (via drill 0.6)
  Top 0.406: R24.2 28.95,42.49 29.05,42.39
  Top 0.813: D2.A 28.48,41.82 29.05,42.39 v31.59,42.39 31.65,42.33 C3.2 31.75,40.86 C2.2
  Bottom 0.305: v31.59,42.39 32.38,41.59 32.38,24.21 33.42,23.18 33.42,15.16 34.92,13.65 36.43,13.65 38.73,11.35 38.73,8.25 37.54,7.06 35.48,7.06 35.08,7.46 25.04,7.46 SV3.1
  pour Top (no thermals): 33.18,40.32 31.12,40.32 31.12,41.59 30.64,42.07 30.64,42.7 33.97,42.7 34.92,41.75 34.92,40.48 34.77,40.32
GND2  (via drill 0.51)
  Top 0.254: Q2.P2 12.13,8.59 v12.3,8.41 13.32,7.39 Q1.P2
  Top 0.305: Q3.P2 6.6,6.65 6.83,6.43 6.83,5.87 v6.91,5.79
  Top 0.406: C5.2 32.12,8.07 | LED4.C 6.47,9.29 v7.38,9.29
  Top 0.813: 32.12,8.07 30.96,6.91 30.96,1.98 v30,1.03
  Bottom 0.305: 26.19,2.54 26.04,2.54 24.77,1.27 SV3.3
  Bottom 0.406: v30,1.03 28.5,2.54 26.19,2.54
  other vias: 19.05,2.94 20.5,2.01
  pour Top (rank 6): 38.1,15.24 31.75,15.24 30.48,13.97 29.21,12.7 29.21,7.62 30.48,6.35 44.45,6.35 45.72,7.62 45.72,8.89 39.37,15.24
  pour Top (rank 6): 4.29,0 25.4,0 25.64,0.24 25.64,1.98 17.78,9.84 1.67,9.84 0,8.18 0,0
  pour Bottom (rank 5): 4.29,0 25.4,0 25.64,0.24 25.64,1.98 17.78,9.84 1.67,9.84 0,8.18 0,0
I_SENSE  (via drill 0.51)
  Top 0.203: U1.P4 24.13,31.91 23.65,31.43 23.65,29.05 23.97,28.73 R12.2
  Top 0.254: U4.P4 26.26,27.79 v25.72,28.34 25.32,28.73 R12.2 | U6.P7 26.6,8.29 v26.67,8.22
  Bottom 0.203: v25.72,28.34 25.72,27.7 29.21,24.21 29.21,17.78 27.94,16.51 TP4.P$1 28.26,14.92 28.26,9.52 26.96,8.22 v26.67,8.22
LED1  (via drill 0.51)
  Top 0.203: 28.34,9.76 28.65,10.08 28.65,12.94 26.59,15 26.59,15.32 25.88,16.03 25.64,16.03 25.24,16.43 25.24,17.07 26.26,18.09 U4.P15 | 28.34,9.76 27.79,9.76 U6.P9 | 28.34,9.76 28.73,9.37 28.73,7.86 28.34,7.46 21.43,7.46 v21.27,7.62 | v11.83,7.3 10.64,7.3 Q2.P1
  Bottom 0.203: v21.27,7.62 21.27,7.06 21.11,6.91 21.11,5.87 20.24,5 18.65,5 17.14,6.51 12.62,6.51 v11.83,7.3
LED2  (via drill 0.51)
  Top 0.203: U4.P16 26.76,20.65 26.67,20.56 26.67,17.38 v26.04,16.75 | v7.06,7.94 5.9,7.94 Q3.P1
  Top 0.254: 25.32,9.1 U6.P5 25.01,9.1 v24.61,8.71
  Bottom 0.203: v26.04,16.75 26.43,16.35 26.43,14.21 27.46,13.18 27.46,9.84 27.07,9.45 25.34,9.45 v24.61,8.71 23.67,7.78 22.54,7.78 21.51,6.75 21.51,5.71 20.4,4.6 18.49,4.6 17.07,6.03 8.97,6.03 v7.06,7.94
LED3  (via drill 0.51)
  Top 0.203: U4.P17 27.26,20.59 27.07,20.4 27.07,16.91 v27.23,16.75 | v13.33,5 13.32,5.01 Q1.P1
  Top 0.254: U6.P6 26.1,8.77 v25.56,8.22
  Bottom 0.203: v27.23,16.75 26.83,16.35 26.83,14.45 27.86,13.41 27.86,9.68 27.23,9.05 26.38,9.05 v25.56,8.22 25.13,8.22 24.29,7.38 22.7,7.38 21.91,6.59 21.91,5.56 20.56,4.21 18.34,4.21 17.54,5 v13.33,5
N$1  (via drill 0.51)
  Top 0.254: U2.P1 26.13,33.67 v25.8,33.34
  Top 0.406: v29.84,28.18 29.58,28.44 R15.1 R16.2
  Bottom 0.203: v29.84,28.18 28.97,29.05 27.86,29.05 26.91,30 26.91,32.23 v25.8,33.34
N$2
  Top 0.813: J23.N 13.84,38.93 15.08,40.16 R1.1
N$3
  Top 0.61: 25.41,40.32 C1.1
  Top 0.813: R8.2 24.29,36.99 24.77,37.46 24.77,39.99 C1.1
  pour Top (no thermals): 27.15,38.58 25.24,38.58 25.24,41.43 26.51,41.43 27.3,40.64 27.3,39.69 27.15,39.53
N$4
  Top 0.203: C13.1 L3.1
N$5
  Top 0.203: C24.2 22.64,8.78 X2.1 22.76,8.78 23.57,8.78 24.57,9.77 U6.P4
N$6
  Top 0.203: U6.P3 22.85,10.27 X2.2 22.64,10.37 C23.2
N$7
  Top 0.305: R2.1 10.48,3.18 10.72,3.41 10.72,3.77 LED1.A
N$8
  Top 0.305: LED1.C 10.95,6.34 Q1.P3
N$9
  Top 0.254: U1.P3 22.78,31.51 22.78,30.11 R13.2 R12.1
N$10
  Top 0.203: U2.P3 24.83,33.2 25.56,32.46 25.56,31.96 RF.1
  Top 0.305: U2.P3 24.83,35.52 RI2.2
  Top 0.406: RI1.2 RI2.2
N$11
  Top 0.305: LED2.C 9.52,7.46 9.05,7.94 Q2.P3
N$12
  Top 0.305: R3.1 9.21,3.1 9.45,3.33 9.45,3.93 LED2.A
N$13
  Top 0.254: L2.2 19.97,30.83 20.64,30.16
  Top 0.406: R9.1 21.11,31.51 21.51,31.11 R11.2 21.46,30.32 20.8,30.32 20.64,30.16 20.23,29.75 R7.2
N$14
  Top 0.305: R4.1 7.94,3.85 LED3.A
N$15
  Top 0.254: 8.08,5.52 LED3.C
  Top 0.305: Q3.P3 8.08,5.52
N$16
  Top 0.406: U1.P1 22.05,33.35 21.75,33.66 21.33,33.66 R9.2 20.95,34.03 20.95,34.45 20.64,34.77 20.64,36.2 20.33,36.5 L1.1
N$17
  Top 0.406: R25.1 5.18,10.91 LED4.A
N$19
  Top 0.203: U4.P22 29.14,24.06 29.84,24.77 30.58,24.77 X1.1 30.74,24.92 C18.2
N$21
  Top 0.254: D4.P3 15.82,27.15 C13.2
N$22
  Top 0.254: R18.1 C11.1 C12.1 17.09,25.9 17.78,26.59 17.78,27.38 18.18,27.78 18.76,27.78 D4.P2
N$23
  Top 0.254: U4.P18 27.76,19.81 C16.2
N$24
  Top 0.203: U4.P21 29.14,23.56 29.84,22.86 30.38,22.86 X1.2 32.07,23.12 C17.2
N$25
  Top 0.406: L1.2 19.37,32.84 L2.1
RST  (via drill 0.51)
  Top 0.203: 24.13,21.35 24.27,21.35 v24.61,21.01 | J21.P10 17.46,8.89 17.94,9.37 17.94,12.62 19.53,14.21 v20.16,14.21
  Top 0.254: U4.P12 24.54,21.76 24.13,21.35 23.52,21.35 R19.1 | U6.P15 26.1,12.24 25.24,13.1 v25.24,13.41
  Bottom 0.203: v24.61,21.01 23.81,20.22 23.81,14.21 | 23.81,14.21 24.37,13.65 25,13.65 v25.24,13.41 | v20.16,14.21 20.72,14.21 20.88,14.05 23.65,14.05 23.81,14.21
RX  (via drill 0.51)
  Top 0.203: U3.P1 20.78,25.26 v20.89,25.08 | U4.P14 25.76,20.05 v25.32,19.61 | TP12.P$1 25.66,14.82 27.86,12.62 27.86,11.36 U6.P12
  Bottom 0.203: v20.89,25.08 22.54,26.67 25,26.67 25.32,26.35 25.32,25.48 25,25.16 25,21.91 25.72,21.19 25.72,20 v25.32,19.61 | 25.64,19.92 v25.32,19.61 | v25.32,19.61 25.32,15.3 TP12.P$1
RX_BITLINE
  Top 0.254: R18.2 C11.2 18.93,23.96 U3.P3 20,22.96 R17.1
SWDCLK  (via drill 0.51)
  Top 0.152: 16.51,5.71 17.62,5.71
  Top 0.203: J21.P4 15.88,5.16 | 15.88,5.16 14.92,6.11 14.92,6.75 13.89,7.78 13.89,8.33 13.02,9.21 13.02,9.34 R22.1 | 15.88,5.16 15.95,5.16 16.51,5.71 | 17.62,5.71 18.26,6.35 18.41,6.35 18.81,6.75 18.81,7.38 19.29,7.86 20.08,7.86 20.32,8.1 20.32,12.94 v20.24,13.02
  Top 0.254: U6.P14 26.6,12.85 v26.51,12.94
  Bottom 0.203: v26.51,12.94 26.27,12.94 26.04,12.7 24.77,12.7 23.89,13.57 20.8,13.57 v20.24,13.02
SWDDIO  (via drill 0.51)
  Top 0.152: 16.51,8.25 17.54,8.25
  Top 0.203: J21.P2 15.88,7.78 16.03,7.78 16.51,8.25 | 17.54,8.25 17.62,8.25 18.41,9.05 18.41,11.91 19.13,12.62 v19.21,12.62
  Top 0.254: 15.88,7.78 14.37,9.29 14.37,12.46 14.13,12.7 R21.1 | U6.P16 25.49,12.06 v24.21,12.06
  Bottom 0.203: v19.21,12.62 19.76,12.06 v24.21,12.06
TCK  (via drill 0.51)
  Top 0.203: J21.P7 17.3,5.24 18.34,5.24 v18.89,5.79 | U4.P10 24.49,23.52 v23.26,23.52
  Bottom 0.203: v23.26,23.52 23.81,22.96 23.81,22.23 22.78,21.19 22.78,18.41 20.64,16.27 18.81,16.27 18.02,15.48 18.02,11.03 18.89,10.16 v18.89,5.79
TDI  (via drill 0.51)
  Top 0.203: J21.P3 15.88,6.51 14.6,7.78 14.6,8.41 13.81,9.21 13.81,10.72 13.1,11.43 | 13.1,11.43 R6.2 | 13.1,11.43 13.02,11.51 13.02,14.68 arc-90 13.18,14.84 14.53,14.84 14.68,14.68 v16.75,14.68
  Top 0.254: U4.P8 24.02,24.56 23.65,24.92 23.65,25.08 v23.5,25.24
  Bottom 0.203: v23.5,25.24 22.38,25.24 21.99,24.84 21.99,18.73 20.32,17.07 18.34,17.07 16.75,15.48 v16.75,14.68
TDO  (via drill 0.51)
  Top 0.203: v15.56,13.97 14.6,13.97
  Top 0.254: J21.P1 15.48,8.89 14.84,9.52 14.84,13.73 14.6,13.97 R5.2 14.37,13.97 | U4.P7 24.54,25.87 v24.45,25.96
  Bottom 0.203: v24.45,25.96 22.54,25.96 21.61,25 21.61,19.07 20,17.46 18.1,17.46 15.56,14.92 v15.56,13.97
TEST  (via drill 0.51)
  Top 0.203: J21.P8 17.38,6.35 v18.1,7.06 | U4.P11 24.49,23.02 23.89,23.02 23.35,22.48 v23.02,22.48
  Bottom 0.203: v23.02,22.48 22.38,21.84 22.38,18.57 20.48,16.67 18.57,16.67 17.62,15.72 17.62,10.79 18.1,10.32 v18.1,7.06
TMS  (via drill 0.51)
  Top 0.152: 16.51,4.45 17.62,4.45
  Top 0.203: R20.2 12.84,3.81 J21.P5 16.51,4.45 | 17.62,4.45 19.13,4.45 19.92,5.24 19.92,5.79 v20,5.87
  Top 0.254: U4.P9 23.88,24.06 23.57,24.37 22.79,24.37 v22.7,24.46
  Bottom 0.203: v22.7,24.46 22.71,24.45 23.34,24.45 24.21,23.57 24.21,22.07 23.18,21.03 23.18,18.26 20.8,15.88 19.05,15.88 18.41,15.24 18.41,11.19 19.57,10.04 19.53,10 19.53,6.51 20,6.03 v20,5.87
TX  (via drill 0.51)
  Top 0.203: Q4.P3 Q4.P4 20.1,20.48 24.05,20.48 24.29,20.24 | 25.26,21.37 U4.P13 25.24,21.82 25.24,21.35 25.32,21.27 25.32,20.64 24.92,20.24 24.29,20.24 | 24.29,20.24 24.29,16.91 arc90 v24.53,16.67 | v24.53,16.67 23.97,16.67 TP13.P$1 | v24.53,16.67 24.53,16.59 25.48,15.64 25.72,15.64 26.19,15.16 26.19,14.84 28.26,12.78 28.26,10.87 28.16,10.77 U6.P11
V+
  Top 0.305: R4.2 R3.2 R2.2 10.9,0.71 20.88,0.71 22.7,2.54
  Top 0.406: 22.7,2.54 25.88,2.54 SV2.1 28.81,1.27 30,2.46 30,7.46 30.42,7.88 C5.1 | R4.2 7.72,1.27 2.54,1.27 1.27,2.54 1.27,7.62 2.96,9.31 R25.2
  pour Top (no thermals): 30.8,10.95 30.24,10.95 29.92,10.64 29.92,7.94 30.96,7.94 31.04,8.02 31.04,10 31.43,10.4 31.43,10.95
V_SENSE  (via drill 0.51)
  Top 0.203: U2.P4 24.83,32.09 25.4,31.51 25.4,29.84 25.72,29.53 26.3,29.53 RF.2
  Top 0.254: U4.P3 26.76,28.27 v26.83,28.34 26.35,28.81 RF.2 | U6.P8 27.1,8.9 v28.02,8.22
  Bottom 0.203: v26.83,28.34 30,25.16 30,18.02 30.48,17.54 TP3.P$1 30.48,10.92 v28.02,8.22
VCC  (via drill 0.51)
  Top 0.406: J23.P 31.88,33.1 v33.5,33.1
  Bottom 0.305: v33.5,33.1 33.5,31.43 33.02,30.96 33.02,24.61 34.05,23.57 34.05,15.48 35.24,14.29 36.67,14.29 39.37,11.59 39.37,7.78 37.94,6.35 SV1.3
  pour Top (rank 2, no thermals): 28.42,39.21 28.42,37.94 30.48,37.94 30.48,31.75 31.12,31.11 32.54,31.11 32.7,31.27 32.7,34.13 34.29,35.72 34.29,36.67 32.86,38.1 32.23,38.1 30.48,39.85 30.48,41.43 29.37,41.43 29.37,40.16
VCCINT
  Bottom 0.406: SV1.2 31.75,3.81 29.21,6.35 SV2.3
VEE  (via drill 0.51)
  Top 0.305: R10.2 34.39,38 34.77,37.62 34.77,35.08 v33.97,34.29
  Top 0.406: R23.2 34.45,33.81 v33.97,34.29
  Bottom 0.305: SV1.1 36.83,1.27 39.37,3.81 39.37,5.71 40.72,7.06 40.72,12.3 34.61,18.41 34.61,23.81 33.66,24.77 33.66,30.72 34.45,31.51 34.45,33.81 v33.97,34.29
  pour Top (no thermals): 33.5,37.78 34.13,37.78 34.13,38.26 34.77,38.89 34.77,39.69 34.13,39.69 33.18,39.69 32.86,39.37 32.86,38.89 33.5,38.26
VIN
  Top 0.203: U5.P3 34.61,12.7 34.92,12.38 34.92,9.9 C19.1
  pour Top (no thermals): 33.02,11.03 36.27,11.03 37.62,9.68 37.62,8.73 36.91,8.02 34.69,8.02 34.69,10.08 34.21,10.56 33.02,10.56
VTEST
  Top 0.406: R8.1 RI1.1
  Top 0.813: R1.2 19.83,40.16 C1.2 20.32,40.31 20.32,38.89 20.64,38.58 20.95,38.58 21.85,37.68 R8.1

### Text on the board
tPlace: SDeBruin 11.5 v1 | - | + | uS | RAW | PEG | REG